# Altium schematic sheet Conector_Fdc.SchDoc
size A4
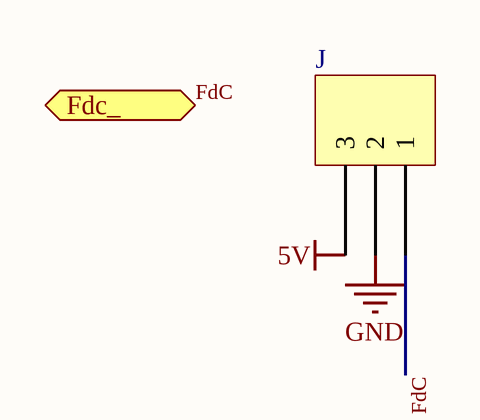
[diagram p0: Conector_Fdc.SchDoc]

## Parts
J  282834-3  [TE 282834-3]  (value not drawn)

## Ports
Fdc_ (out)

## Nets
5V: J.3
GND: J.2
FdC: J.1 ; port Fdc_

## Library data of the parts
J = 282834-3: TERM BLOCK 3POS SIDE ENT 2.54MM; Manufacturer: TE Connectivity AMP Connectors; TemperatureRange: -40C ~ 105C; Voltage: 150V; Pitch: 0.100" (2.54mm); Number Of Levels: 1; Positions Per Level: 3; Part Number: 282834-3; PartId: 9290; Supplier 1: Digi-Key; Supplier Part Number 1: A98334-ND; ComponentLink1Description: Datasheet; ComponentLink1URL: http://www.te.com/commerce/DocumentDelivery/DDEController?Action=srchrtrv&DocNm=282834&DocType=Customer+Drawing&DocLang=English; ComponentLink2Description: Digi-Key Listing; ComponentLink2URL: http://www.digikey.ca/product-detail/en/282834-3/A98334-ND/1153264; Price: 2,25; Colour: Green; Orientation: Horizontal with Board